# Altium schematic sheet amplifier.SchDoc
size A4; SheetNumber: 1; SheetTotal: 1
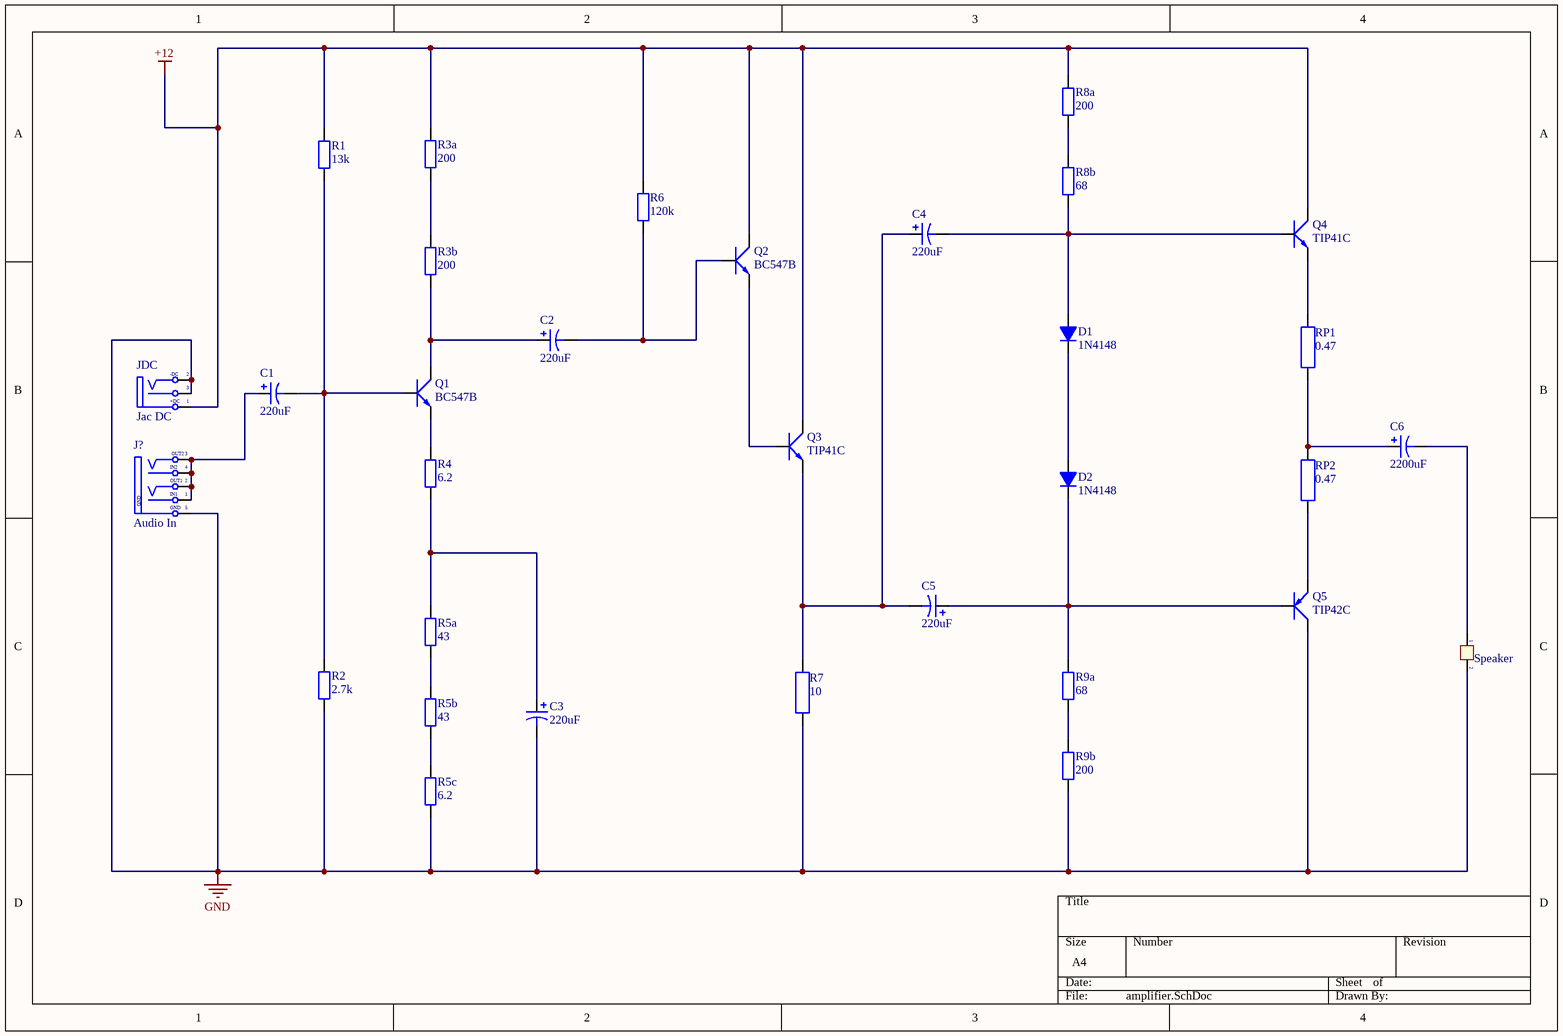
[diagram p0: amplifier.SchDoc]

## Parts
C1  220uF  [C5mm]
C2  220uF  [C5mm]
C3  220uF  [C5mm]
C4  220uF  [C5mm]
C5  220uF  [C5mm]
C6  2200uF  [C5mm]
D1  1N4148  [D0.5A]
D2  1N4148  [D0.5A]
J?  Audio In  [CON Phone2]
JDC  Jac DC  [DC0]
Q1  BC547B  [QTO-92]
Q2  BC547B  [QTO-92]
Q3  TIP41C  [QTO-220]
Q4  TIP41C  [QTO-220]
Q5  TIP42C  [QTO-220]
R1  13k  [R1/4W]
R2  2.7k  [R1/4W]
R3a  200  [R1/4W]
R3b  200  [R1/4W]
R4  6.2  [R1/4W]
R5a  43  [R1/4W]
R5b  43  [R1/4W]
R5c  6.2  [R1/4W]
R6  120k  [R1/4W]
R7  10  [DIEN TRO 10W]
R8a  200  [R1/4W]
R8b  68  [R1/4W]
R9a  68  [R1/4W]
R9b  200  [R1/4W]
RP1  0.47  [DIEN TRO 1W (tube)]
RP2  0.47  [DIEN TRO 1W (tube)]
Speaker  Jumper 2  [jp2h]  (value not drawn)

## Nets
+12: JDC.1(T) Q2.3(C) Q3.2(C) Q4.2(C) R1.2 R3a.2 R6.2 R8a.2
GND: C3.2 J?.5(GND) JDC.2(TN) JDC.3(S) Q5.2(C) R2.1 R5c.1 R7.1 R9b.1 Speaker.2
NetC1_1: C1.1 J?.1(S1) J?.2(S1) J?.3(TN) J?.4(S)
NetC1_2: C1.2 Q1.2(B) R1.1 R2.2
NetC2_1: C2.1 Q1.3(C) R3b.1
NetC2_2: C2.2 Q2.2(B) R6.1
NetC3_1: C3.1 R4.1 R5a.2
NetC4_1: C4.1 C5.2 Q3.3(E) R7.2
NetC4_2: C4.2 D1.1(A) Q4.1(B) R8b.1
NetC5_1: C5.1 D2.2(K) Q5.1(B) R9a.2
NetC6_1: C6.1 RP1.1 RP2.2
NetC6_2: C6.2 Speaker.1
NetD1_2: D1.2(K) D2.1(A)
NetQ1_1: Q1.1(E) R4.2
NetQ2_1: Q2.1(E) Q3.1(B)
NetQ4_3: Q4.3(E) RP1.2
NetQ5_3: Q5.3(E) RP2.1
NetR3a_1: R3a.1 R3b.2
NetR5a_1: R5a.1 R5b.2
NetR5b_1: R5b.1 R5c.2
NetR8a_1: R8a.1 R8b.2
NetR9a_1: R9a.1 R9b.2

## Notes on the sheet
- (in symbol CON Phone2) OUT2; IN2; OUT1; IN1
- (in symbol DCIN) -DC; +DC

## Library data of the parts
C1-C6 = Cap Pol 5mm: Polarized Capacitor (Axial); Published: 8-Jun-2000; LatestRevisionDate: 17-Jul-2002; LatestRevisionNote: Re-released for DXP Platform.; PackageReference: POLAR0.8; Publisher: Altium Limited
D1 D2 = D0.5A: Value: 1N4148
J? = CON Phone2: Jac Phone Stereo; Creat by: VanDungEvn@Gmail.com
JDC = DCIN: Jac DC input; Value: Jac DC
Q1 Q2 = NPN_EBC: P 600mW, EBC; Value: C9014
Q3 Q4 = TIP41C: NPN 2W, BCE; Value: TIP41C
Q5 = TIP42C: PNP 2W, BCE; Value: TIP42C
R1 R2 R3a R3b R4 R5a R5b R5c R6 R8a R8b R9a R9b = R1/4W: Resistor 1/4W; Value: R1/4W - 1K
R7 = Res 10 W: 10W Res Power; Creator: Nguyen Ba Bien
RP1 RP2 = Res 1W: 1W Res Power; Creator: Nguyen Ba Bien
Speaker = JP 2: Value: JP 2